# Altium schematic sheet Thrusters.SchDoc
size A
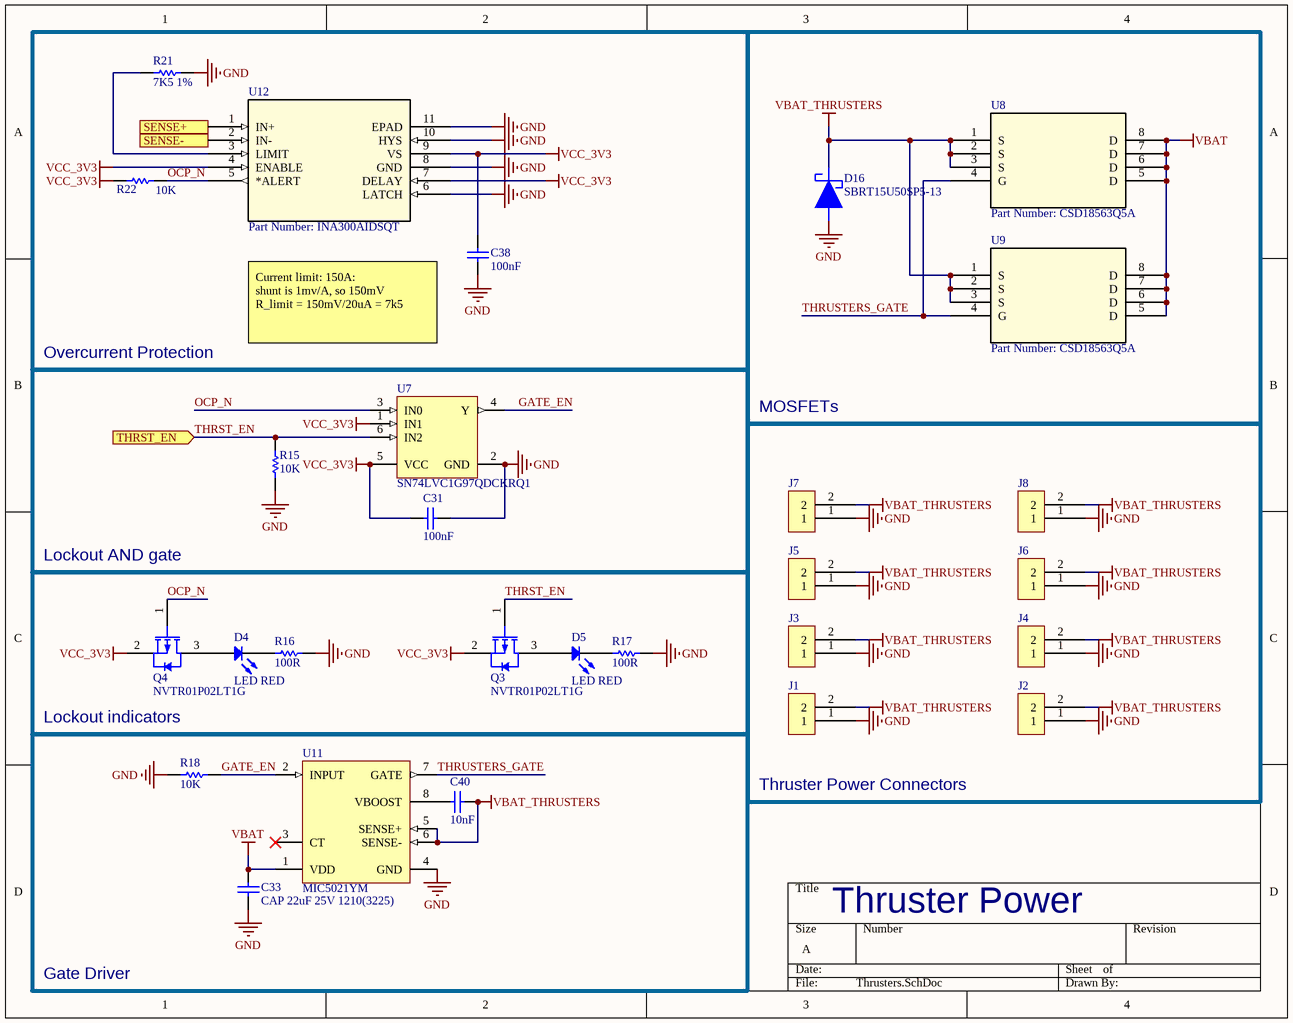
[diagram p0: Thrusters.SchDoc]

## Parts
C31  100nF  [CAPC0603(1608)100_N]
C33  CAP 22uF 25V 1210(3225)  [CAPC1210(3225)220_L]
C38  100nF  [CAPC0603(1608)100_N]
C40  10nF  [CAPC0603(1608)100_L]
D4  LED RED  [LED_0805]
D5  LED RED  [LED_0805]
D16  SBRT15U50SP5-13  [SBRT15U50SP5-13]
J1  (no value)  [2-pin Megafit RA]
J2  (no value)  [2-pin Megafit RA]
J3  (no value)  [2-pin Megafit RA]
J4  (no value)  [2-pin Megafit RA]
J5  (no value)  [2-pin Megafit RA]
J6  (no value)  [2-pin Megafit RA]
J7  (no value)  [2-pin Megafit RA]
J8  (no value)  [2-pin Megafit RA]
Q3  NVTR01P02LT1G  [ONSC-SOT-23-3-318-08_V]
Q4  NVTR01P02LT1G  [ONSC-SOT-23-3-318-08_V]
R15  10K  [RESC0603(1608)_N]
R16  100R  [RESC0603(1608)_N]
R17  100R  [RESC0603(1608)_N]
R18  10K  [RESC0603(1608)_N]
R21  7K5 1%  [RESC0603(1608)_N]
R22  10K  [RESC0603(1608)_N]
U7  SN74LVC1G97QDCKRQ1  [DCK0006A_L]
U8  Part Number: CSD18563Q5A  [DQJ8]
U9  Part Number: CSD18563Q5A  [DQJ8]
U11  MIC5021YM  [MICL-SOICN-8LD-PL-1_V]
U12  Part Number: INA300AIDSQT  [DSQ10_P9X1P5]

## Blocks framed on the sheet
Overcurrent Protection: C38 R21 R22 U12
MOSFETs: D16 U8 U9

## Ports
SENSE+, SENSE-, THRST_EN (in)

## Nets
GND: C31.1 C33.1 C38.1 D16.1 J1.1 J2.1 J3.1 J4.1 J5.1 J6.1 J7.1 J8.1 R15.2 R16.2 R17.2 R18.2 R21.2 U7.2(GND) U11.4(GND) U12.6(LATCH) U12.8(GND) U12.10(HYS) U12.11(EPAD)
VBAT: C33.2 U8.5(D) U8.6(D) U8.7(D) U8.8(D) U9.5(D) U9.6(D) U9.7(D) U9.8(D) U11.1(VDD)
VBAT_THRUSTERS: C40.2 D16.2 J1.2 J2.2 J3.2 J4.2 J5.2 J6.2 J7.2 J8.2 U8.1(S) U8.2(S) U8.3(S) U9.1(S) U9.2(S) U9.3(S) U11.5(SENSE+) U11.6(SENSE-)
VCC_3V3: C31.2 C38.2 Q3.2(S) Q4.2(S) R22.2 U7.1(IN1) U7.5(VCC) U12.4(ENABLE) U12.7(DELAY) U12.9(VS)
GATE_EN: R18.1 U7.4(Y) U11.2(INPUT)
OCP_N: Q4.1(G) R22.1 U7.3(IN0) U12.5(*ALERT)
SENSE+: U12.1(IN+) ; port SENSE+
SENSE-: U12.2(IN-) ; port SENSE-
THRST_EN: Q3.1(G) R15.1 U7.6(IN2) ; port THRST_EN
THRUSTERS_GATE: U8.4(G) U9.4(G) U11.7(GATE)
NetC40_1: C40.1 U11.8(VBOOST)
NetD4_1: D4.1(K) R16.1
NetD4_2: D4.2(A) Q4.3(D)
NetD5_1: D5.1(K) R17.1
NetD5_2: D5.2(A) Q3.3(D)
NetR21_1: R21.1 U12.3(LIMIT)

Not connected (* = marked no-connect by the designer): U11 3(CT)*

## Notes on the sheet
- (near C38) Current limit: 150A:
  shunt is 1mv/A, so 150mV
  R_limit = 150mV/20uA = 7k5
- Lockout AND gate
- Lockout indicators
- Thruster Power Connectors
- Thruster Power
- Gate Driver

## Library data of the parts
C31 C38 = CMP-1035-02580-1: CAP 100nF 10V ±10% 0603 (1608 Metric) Thickness 1mm SMD; Tolerance: Â±10%; Case-EIA: 0603; Case-Metric: 1608; Max Thickness: 1 mm; Value: 100nF; Rated Voltage: 10 V; Technology: SMT
C33 = CMP-1038-02286-1: CAP 22uF 25V -20% to +80% 1210 (3225 Metric) Thickness 2.2mm SMD; Case-Metric: 3225; Case-EIA: 1210; Rated Voltage: 25 V; Technology: SMT; Max Thickness: 2.2 mm; Value: 22uF; Tolerance: -20% to +80%
C40 = CMP-1035-02315-1: CAP 10nF 25V ±2% 0603 (1608 Metric) Thickness 1mm SMD; Tolerance: Â±2%; Case-Metric: 1608; Case-EIA: 0603; Rated Voltage: 25 V; Technology: SMT; Max Thickness: 1 mm; Value: 10nF
D4 D5 = LED0: led / LTST-C171KRKT; Manufacturer: Lite-On Inc.; Lens Color: Colorless; Lens Transparency: Clear; Millicandela Rating: 54mcd; Lens Style/Size: Rectangle with Flat Top, 1.40mm x 1.25mm; Voltage - Forward (Vf) (Typ): 2V; Current - Test: 20mA; Viewing Angle: 130°; Wavelength - Dominant: 631nm; Wavelength - Peak: 639nm; Supplier 1: Digi-Key; Supplier Part Number 1: 160-1427-1-ND; Manufacturer Part Number: LTST-C171KRKT; RoHS: RoHS Compliant; Category: Optoelectronics; Stock 1: 260544; Pricing 1: 1=0.31, 10=0.225, 25=0.1656, 100=0.1183, 250=0.0804, 500=0.07096, 1000=0.05558 (USD); Packaging: Cut Tape (CT); Part Status: Active; Color: Red; Mounting Type: Surface Mount; Features: -; Package / Case: 0805 (2012 Metric); Size / Dimension: 2.00mm L x 1.25mm W; Height (Max): 0.80mm; ComponentLink1URL: http://optoelectronics.liteon.com/upload/download/DS22-2000-109/LTST-C171KRKT.pdf; ComponentLink1Description: http://optoelectronics.liteon.com/upload/download/DS22-2000-109/LTST-C171KRKT.pdf
D16 = SBRT15U50SP5-13: Manufacturer: Diodes Incorporated; Diode Type: Super Barrier; Current - Average Rectified (Io): 15A; Speed: Fast Recovery =< 500ns, > 200mA (Io); Supplier 1: Digi-Key; Supplier Part Number 1: SBRT15U50SP5-13DICT-ND; Manufacturer Part Number: SBRT15U50SP5-13; RoHS: RoHS Compliant; Category: Discrete Semiconductor Products; Stock 1: 12134; Pricing 1: 1=0.93, 10=0.823, 100=0.6306, 500=0.49852, 1000=0.39882 (USD); Packaging: Cut Tape (CT); Part Status: Active; Capacitance @ Vr, F: -; Mounting Type: Surface Mount; Package / Case: PowerDI™ 5; Supplier Device Package: PowerDI®5; Operating Temperature - Junction: -65°C ~ 150°C; ComponentLink1URL: https://media.digikey.com/pdf/Data%20Sheets/Diodes%20PDFs/SBRT15U50SP5.pdf; ComponentLink1Description: https://media.digikey.com/pdf/Data%20Sheets/Diodes%20PDFs/SBRT15U50SP5.pdf
J1-J8 = 2-pin megafit
Q3 Q4 = CMP-1058-00752-1: Power MOSFET, -20 V, -1.3 A, P-Channel, 3-Pin SOT-23, Pb-Free, Tape and Reel; Manufacturer: On Semiconductor; Ciss Typ (pF): 225; Configuration: Single; Coss Typ (pF): 130; PD Max (W): 0.4; ID Max (A): 1.3; Crss Typ (pF): 55; VGS Max (V): 12; V(BR)DSS Min (V): 20; VGS(th) Max (V): 1.25; Qrr Typ (nC): 8.5; Channel Polarity: P Channel; ComponentLink1URL: http://www.onsemi.com/; PackageReference: SOT-23-3-318-08; RoHS: Pb-Free; ComponentLink1Description: Manufacturer URL; PackageDescription: 3-Pin Small Outline Transistor, Body 2.92 x 1.3 mm, Pitch 0.95 mm; ComponentLink3Description: Package Specification; ComponentLink2Description: Datasheet; Package Type: SOT-23-3; ComponentLink2URL: http://www.onsemi.cn/pub_link/Collateral/NTR1P02LT1-D.PDF; Packing: Tape and Reel; Mounting Technology: Surface Mount; ComponentLink3URL: http://www.onsemi.cn/pub_link/Collateral/318-08.PDF; PartNumber: NVTR01P02LT1G; PackageVersion: Rev. AP, 11/2009; DatasheetVersion: Rev. 13
R15 R18 R22 = CMP-1012-00098-1: 10K 0.1W 5% 0603 (1608 Metric)  SMD; Case-EIA: 0603; Value: 10000.00 Ohm; Case-Metric: 1608; Technology: SMT; Tolerance: 5 %; Power: 0.1 W
R16 R17 = CMP-1012-00050-1: 100R 0.1W 5% 0603 (1608 Metric)  SMD; Case-EIA: 0603; Value: 100.00 Ohm; Case-Metric: 1608; Tolerance: 5 %; Technology: SMT; Power: 0.1 W
R21 = CMP-1012-00609-1: 7K5 0.1W 1% 0603 (1608 Metric)  SMD; Case-Metric: 1608; Value: 7500.00 Ohm; Case-EIA: 0603; Technology: SMT; Tolerance: 1 %; Power: 0.1 W
U7 = CMP-0859-00512-3: Automotive Catalog Configurable Multiple-Function Gate, DCK0006A, LARGE T&R; Manufacturer: Texas Instruments; Generic Part Number: SN74LVC1G97-Q1; Input Type: CMOS/TTL; tpd @ Nom Voltage(Max)(ns): 16.4,9.3,7.3,6.1; VCC(Max)(V): 5.5; VCC(Min)(V): 1.65; Schmitt Trigger: No; Voltage(Nom)(V): 1.8,2.5,3.3,5; F @ Nom Voltage(Max)(Mhz): 150; Output Drive (IOL/IOH)(Max)(mA): 32/-32; Technology Family: LVC; Logic: True; Output Type: CMOS; ICC @ Nom Voltage(Max)(mA): 0.01; Sub-Family: Configurable Logic; Bits(#): 1; Operating Temperature Range(C): -40 to 125; DatasheetVersion: SCES561D; Gate Type: Configurable; 3-State Output: No; PackageReference: DCK0006A; Rating: Automotive
U8 U9 = CSD18563Q5A: No Description Available; Vendor: Texas Instruments; Built_By: EMA_UL_Team; Manufacturer_Part_Number: CSD18563Q5A; Copyright: Copyright (C) 2018 Accelerated Designs. All rights reserved; RefDes: RefDes; Type: DEV; Value: Value
U11 = CMP-1558-00003-1: High-Speed High-Side MOSFET Driver, 12 to 36 V, -40 to 85 degC, 8-Pin SOIC, RoHS, Tube; VDD Min: 12 V; VDD Max: 36 V; ComponentLink2Description: Datasheet; Temperature Max: 85 degC; PackageDescription: 8-Pin Small Outline Integrated Package, Body 4.89 x 3.90 mm, Pitch 1.27 mm; ComponentLink1Description: Manufacturer URL; RoHS: TRUE; Temperature Min: -40 degC; ComponentLink2URL: http://www.micrel.com/_PDF/mic5021.pdf; PackageVersion: Rev. A; ComponentLink3Description: Package Specification; PartNumber: MIC5021YM; ComponentLink3URL: http://www.micrel.com/_Packages/SOICN-8LD-PL-1.pdf; Packing: Tube; Mounting Technology: Surface Mount; ComponentLink1URL: http://www.micrel.com/
U12 = INA300AIDSQT: No Description Available; Vendor: Texas Instruments; Built_By: EMA_UL_Team; Manufacturer_Part_Number: INA300AIDSQT; Copyright: Copyright (C) 2018 Accelerated Designs. All rights reserved; RefDes: RefDes; Type: DEV; Value: Value